# Altium schematic sheet ADC.SchDoc: uSDR schematic
size Letter; Author: Ye-sheng Kuo; CompanyName: Univ. of Michigan; Revision: 2.0; SheetNumber: 3; SheetTotal: 16
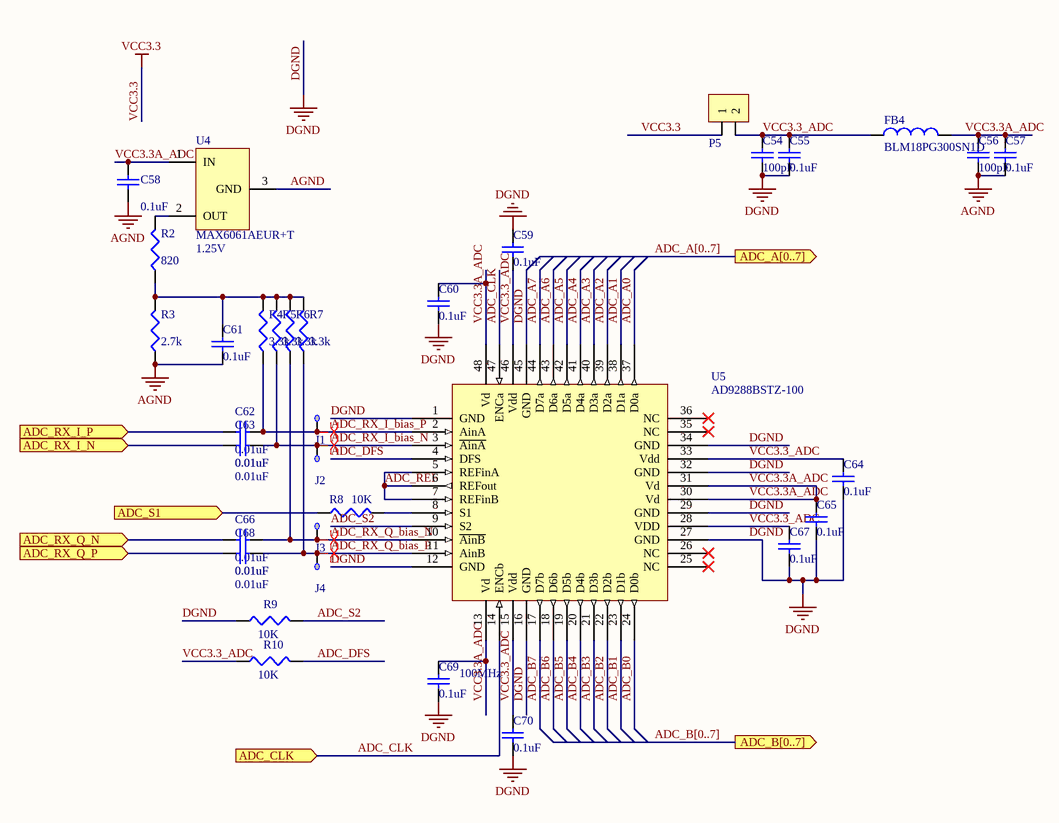
[diagram p0: ADC.SchDoc]

## Parts
C54  100pF  [0402]
C55  0.1uF  [0402]
C56  100pF  [0402]
C57  0.1uF  [0402]
C58  0.1uF  [0402]
C59  0.1uF  [0402]
C60  0.1uF  [0402]
C61  0.1uF  [0402]
C62  0.01uF  [0402]
C63  0.01uF  [0402]
C64  0.1uF  [0402]
C65  0.1uF  [0402]
C66  0.01uF  [0402]
C67  0.1uF  [0402]
C68  0.01uF  [0402]
C69  0.1uF  [0402]
C70  0.1uF  [0402]
FB4  BLM18PG300SN1D  [1608[0603]]
J1  5004  [TestPoint]  (value not drawn)
J2  5004  [TestPoint]  (value not drawn)
J3  5004  [TestPoint]  (value not drawn)
J4  5004  [TestPoint]  (value not drawn)
P5  1 x 2 header  [1x2 header]  (value not drawn)
R2  820  [0402]
R3  2.7K  [0402]
R4  3.3K  [0402]
R5  3.3K  [0402]
R6  3.3K  [0402]
R7  3.3K  [0402]
R8  10K  [0402]
R9  10K  [0402]
R10  10K  [0402]
U4  MAX6061AEUR+T  value 1.25V  [SOT23-3N]
U5  AD9288BSTZ-100  value 100MHz  [TSQFP50P900X900X160-48N]

## Ports
ADC_A[0..7] (out), ADC_B[0..7] (out), ADC_CLK (in), ADC_RX_I_N (in), ADC_RX_I_P (in), ADC_RX_Q_N (in), ADC_RX_Q_P (in), ADC_S1 (in)

## Nets
AGND: C56.1 C57.1 C58.1 C61.1 R3.1 U4.3(GND)
DGND: C54.1 C55.1 C59.2 C60.1 C64.1 C65.1 C67.1 C69.1 C70.1 R9.1 U5.1(GND) U5.12(GND) U5.16(GND) U5.27(GND) U5.29(GND) U5.32(GND) U5.34(GND) U5.45(GND)
VCC3.3: P5.1
ADC_A0: U5.37(D0a)
ADC_A1: U5.38(D1a)
ADC_A2: U5.39(D2a)
ADC_A3: U5.40(D3a)
ADC_A4: U5.41(D4a)
ADC_A5: U5.42(D5a)
ADC_A6: U5.43(D6a)
ADC_A7: U5.44(D7a)
ADC_B0: U5.24(D0b)
ADC_B1: U5.23(D1b)
ADC_B2: U5.22(D2b)
ADC_B3: U5.21(D3b)
ADC_B4: U5.20(D4b)
ADC_B5: U5.19(D5b)
ADC_B6: U5.18(D6b)
ADC_B7: U5.17(D7b)
ADC_CLK: U5.14(ENCb) U5.47(ENCa) ; port ADC_CLK
ADC_DFS: R10.2 U5.4(DFS)
ADC_REF: U5.5(REFinA) U5.6(REFout) U5.7(REFinB)
ADC_RX_I_bias_N: C63.2 J2.1(TB) R5.1 U5.3(~{AinA})
ADC_RX_I_bias_P: C62.2 J1.1(TB) R4.1 U5.2(AinA)
ADC_RX_I_N: C63.1 ; port ADC_RX_I_N
ADC_RX_I_P: C62.1 ; port ADC_RX_I_P
ADC_RX_Q_bias_N: C66.2 J3.1(TB) R6.1 U5.10(~{AinB})
ADC_RX_Q_bias_P: C68.2 J4.1(TB) R7.1 U5.11(AinB)
ADC_RX_Q_N: C66.1 ; port ADC_RX_Q_N
ADC_RX_Q_P: C68.1 ; port ADC_RX_Q_P
ADC_S1: R8.1 ; port ADC_S1
ADC_S2: R9.2 U5.9(S2)
VCC3.3_ADC: C54.2 C55.2 C59.1 C64.2 C67.2 C70.2 FB4.1 P5.2 R10.1 U5.15(Vdd) U5.28(VDD) U5.33(Vdd) U5.46(Vdd)
VCC3.3A_ADC: C56.2 C57.2 C58.2 C60.2 C65.2 C69.2 FB4.2 U4.1(IN) U5.13(Vd) U5.30(Vd) U5.31(Vd) U5.48(Vd)
NetC61_2: C61.2 R2.1 R3.2 R4.2 R5.2 R6.2 R7.2
NetR2_2: R2.2 U4.2(OUT)
NetR8_2: R8.2 U5.8(S1)

Not connected (* = marked no-connect by the designer): U5 25(NC)* 26(NC)* 35(NC)* 36(NC)*

## Buses and harness runs
bus ADC_A[0..7] = port ADC_A[0..7]
bus ADC_B[0..7] = port ADC_B[0..7]

## Layout directives
differential pair: ADC_RX_I_bias_N, ADC_RX_I_bias_P, ADC_RX_Q_bias_N, ADC_RX_Q_bias_P

## Notes on the sheet
- Title
- Date:
- Author:
- Revision:
- Sheet
- of
- University of Michigan
- File:

## Library data of the parts
C54-C70 = Cap Semi: Capacitor (Semiconductor SIM Model); Published: 8-Jun-2000; LatestRevisionDate: 29-May-2009; LatestRevisionNote: IPC-7351 Footprint Added.; PackageReference: C1206; Publisher: Altium Limited; PackageDescription: Chip Capacitor
  C54 C56: Value: 100pF
  C55 C57-C61 C64 C65 C67 C69 C70: Value: 0.1uF
  C62 C63 C66 C68: Value: 0.01uF
FB4 = Ferrite Bead: FERRITE CHIP 30 OHM 1000MA 0603; Supplier 1: Digi-Key; Supplier Part Number 1: 490-1035-2-ND
J1-J4 = TestPoint: TEST POINT PC MINI .040"D YELLOW; Supplier 1: Digi-Key; Supplier Part Number 1: 5004K-ND; datasheet: http://mail.keyelco.com/ENG._DEPT/PDF%20CAT%20NO%20Drawings/5004.pdf
P5 = 1 x 2 header: 100 mils standard header
R2-R10 = Res3: Resistor; Published: 8-Jun-2000; LatestRevisionDate: 29-May-2009; LatestRevisionNote: IPC-7351 Footprint Added.; PackageReference: J1-0603; Publisher: Altium Limited; PackageDescription: Chip Resistor
  R2: Value: 820
  R3: Value: 2.7k
  R4-R7: Value: 3.3k
  R8-R10: Value: 10K
U4 = MAX6061: IC REF VOLT LDO SOT23-3; Supplier 1: Digi-Key; Supplier Part Number 1: MAX6061AEUR+TCT-ND
U5 = AD9288: IC ADC 8BIT DUAL 100MSPS 48-LQFP; Supplier 1: Digi-Key; Supplier Part Number 1: AD9288BSTZ-100-ND